# Altium schematic sheet MD017A ISO-F28027F_0.SchDoc: LAUNCHXL-F28027 NewVersion
size 301 x 237 mm; Date: 7/10/2018 10:05:18 AM; SheetNumber: 1
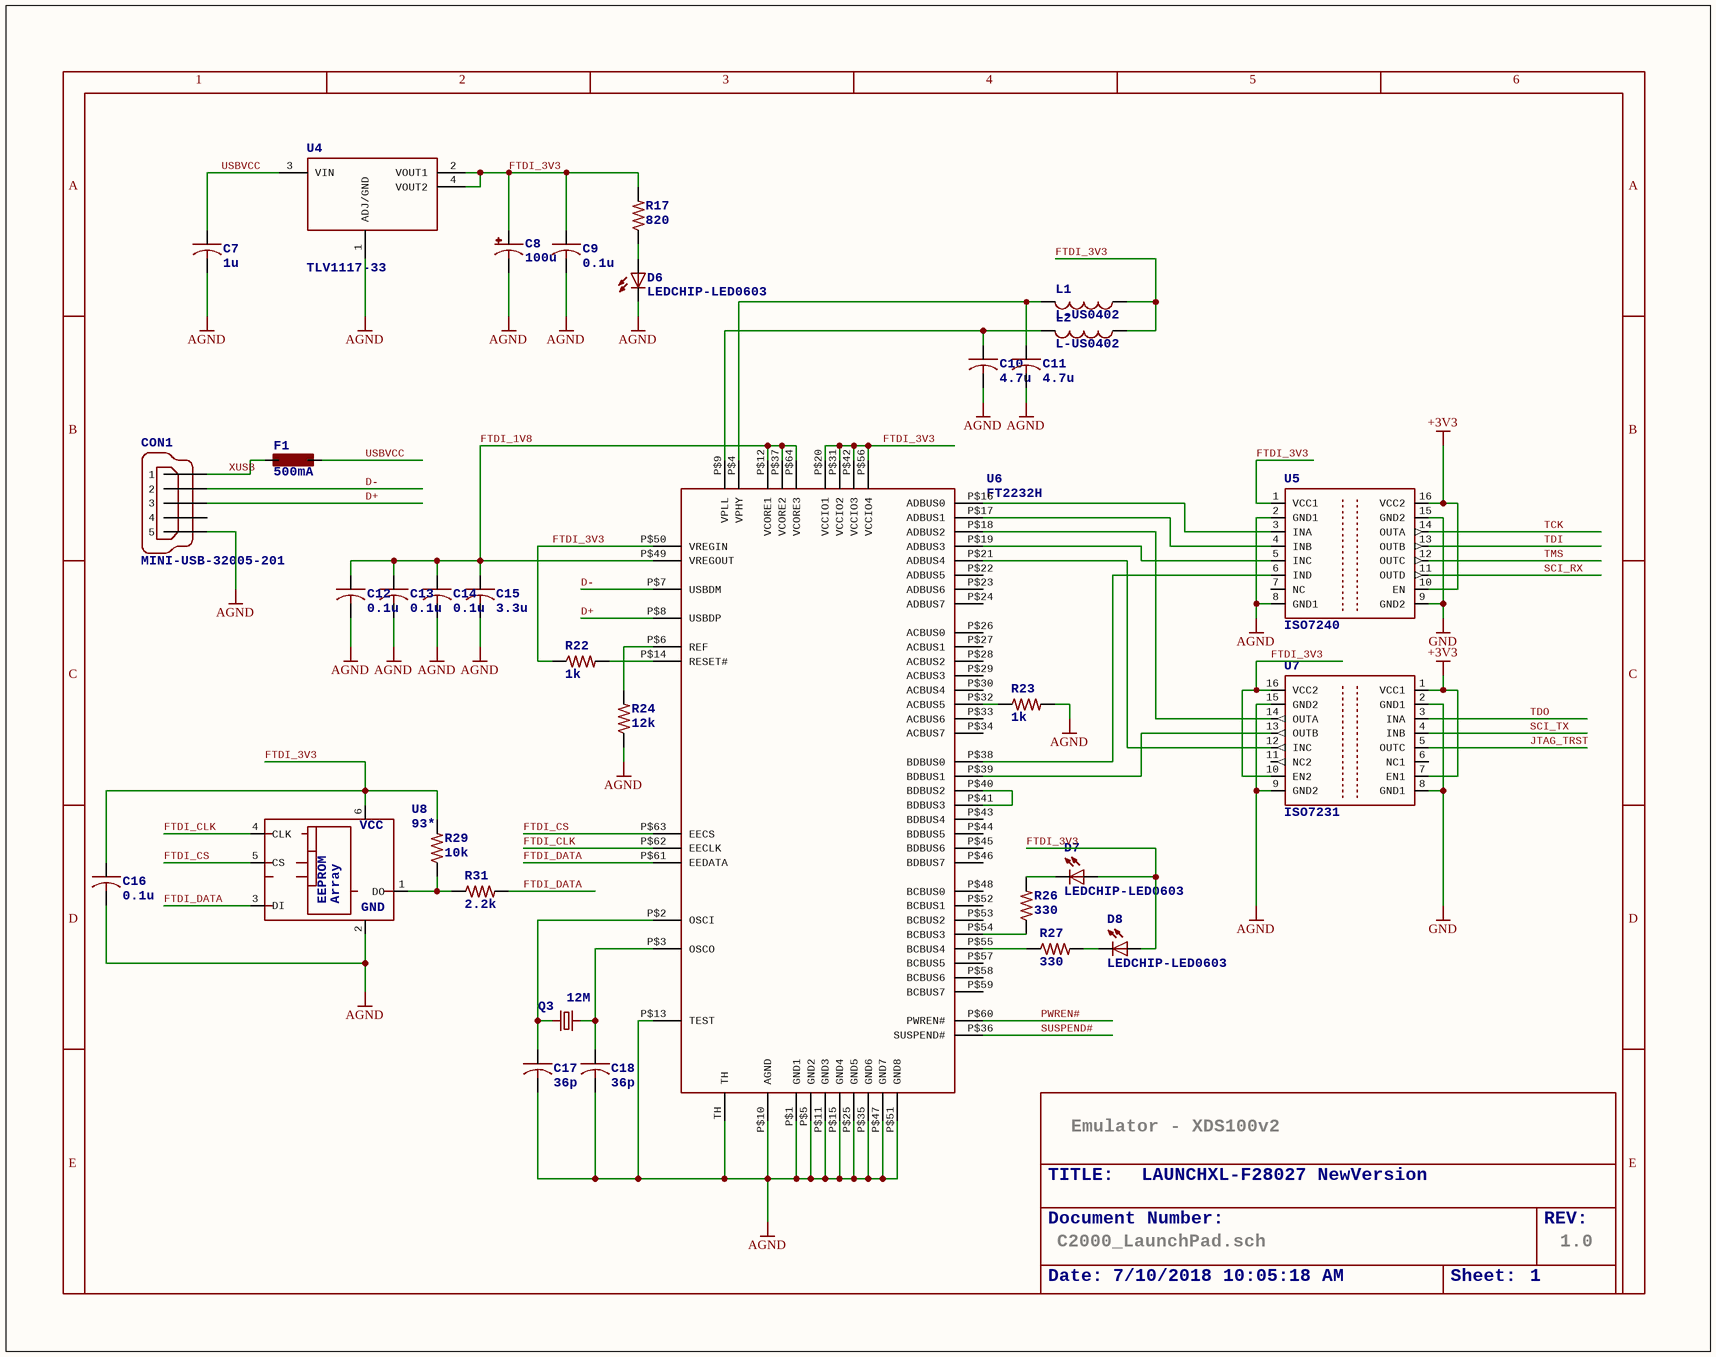
[diagram p0: MD017A ISO-F28027F_0.SchDoc]

## Parts
C7  1u  [C0402]
C8  100u  [B/3528-21R]
C9  0.1u  [C0402]
C10  4.7u  [C0402]
C11  4.7u  [C0402]
C12  0.1u  [C0402]
C13  0.1u  [C0402]
C14  0.1u  [C0402]
C15  3.3u  [C0402]
C16  0.1u  [C0402]
C17  36p  [C0402]
C18  36p  [C0402]
CON1  MINI-USB-32005-201  [32005-201]
D6  LEDCHIP-LED0603  [CHIP-LED0603]
D7  LEDCHIP-LED0603  [CHIP-LED0603]
D8  LEDCHIP-LED0603  [CHIP-LED0603]
F1  500mA  [L1812]
L1  L-US0402  [R0402]
L2  L-US0402  [R0402]
Q3  12M  [HC49UP]
R17  820  [R0402]
R22  1k  [R0402]
R23  1k  [R0402]
R24  12k  [R0402]
R26  330  [R0402]
R27  330  [R0402]
R29  10k  [R0402]
R31  2.2k  [R0402]
U4  TLV1117-33  [SOT223]
U5  ISO7240  [SO-16DW]
U6  FT2232H  [QFN64]
U7  ISO7231  [SO-16DW]
U8  93*  [SOT23-6]

## Nets
+3V3: U5.10(EN) U5.16(VCC2) U7.1(VCC1) U7.7(EN1)
AGND: C7.2 C8.- C9.2 C10.2 C11.2 C12.2 C13.2 C14.2 C15.2 C16.2 C17.2 C18.2 CON1.5 D6.C R23.2 R24.1 U4.1(ADJ/GND) U5.2(GND1) U5.8(GND1) U6.P$1(GND1) U6.P$5(GND2) U6.P$10(AGND) U6.P$11(GND3) U6.P$13(TEST) U6.P$15(GND4) U6.P$25(GND5) U6.P$35(GND6) U6.P$47(GND7) U6.P$51(GND8) U6.TH U7.9(GND2) U7.15(GND2) U8.2(GND)
GND: U5.9(GND2) U5.15(GND2) U7.2(GND1) U7.8(GND1)
D+: CON1.3 U6.P$8(USBDP)
D-: CON1.2 U6.P$7(USBDM)
FTDI_1V8: C12.1 C13.1 C14.1 C15.1 U6.P$12(VCORE1) U6.P$37(VCORE2) U6.P$49(VREGOUT) U6.P$64(VCORE3)
FTDI_3V3: C8.+ C9.1 C16.1 D7.A D8.A L1.1 L2.1 R17.2 R22.1 R29.2 U4.2(VOUT1) U4.4(VOUT2) U5.1(VCC1) U6.P$20(VCCIO1) U6.P$31(VCCIO2) U6.P$42(VCCIO3) U6.P$50(VREGIN) U6.P$56(VCCIO4) U7.10(EN2) U7.16(VCC2) U8.6(VCC)
FTDI_CLK: U6.P$62(EECLK) U8.4(CLK)
FTDI_CS: U6.P$63(EECS) U8.5(CS)
FTDI_DATA: R31.2 U6.P$61(EEDATA) U8.3(DI)
JTAG_TRST: U7.5(OUTC)
PWREN#: U6.P$60(PWREN#)
SCI_RX: U5.11(OUTD)
SCI_TX: U7.4(INB)
SUSPEND#: U6.P$36(SUSPEND#)
TCK: U5.14(OUTA)
TDI: U5.13(OUTB)
TDO: U7.3(INA)
TMS: U5.12(OUTC)
USBVCC: C7.1 F1.1 U4.3(VIN)
XUSB: CON1.1 F1.2
NetC10_1: C10.1 L2.2 U6.P$9(VPLL)
NetC11_1: C11.1 L1.2 U6.P$4(VPHY)
NetC17_1: C17.1 Q3.1 U6.P$2(OSCI)
NetC18_1: C18.1 Q3.2 U6.P$3(OSCO)
NetD6_A: D6.A R17.1
NetD7_C: D7.C R26.2
NetD8_C: D8.C R27.2
NetR22_2: R22.2 U6.P$14(RESET#)
NetR23_1: R23.1 U6.P$32(ACBUS5)
NetR24_2: R24.2 U6.P$6(REF)
NetR26_1: R26.1 U6.P$54(BCBUS3)
NetR27_1: R27.1 U6.P$55(BCBUS4)
NetR29_1: R29.1 R31.1 U8.1(DO)
NetU5_3: U5.3(INA) U6.P$16(ADBUS0)
NetU5_4: U5.4(INB) U6.P$17(ADBUS1)
NetU5_5: U5.5(INC) U6.P$19(ADBUS3)
NetU5_6: U5.6(IND) U6.P$38(BDBUS0)
NetU6_P$18: U6.P$18(ADBUS2) U7.14(OUTA)
NetU6_P$21: U6.P$21(ADBUS4) U7.12(INC)
NetU6_P$39: U6.P$39(BDBUS1) U7.13(OUTB)
NetU6_P$40: U6.P$40(BDBUS2) U6.P$41(BDBUS3)

Not connected (* = marked no-connect by the designer): CON1 4; U5 7(NC); U6 P$22(ADBUS5) P$23(ADBUS6) P$24(ADBUS7) P$26(ACBUS0) P$27(ACBUS1) P$28(ACBUS2) P$29(ACBUS3) P$30(ACBUS4) P$33(ACBUS6) P$34(ACBUS7) P$43(BDBUS4) P$44(BDBUS5) P$45(BDBUS6) P$46(BDBUS7) P$48(BCBUS0) P$52(BCBUS1) P$53(BCBUS2) P$57(BCBUS5) P$58(BCBUS6) P$59(BCBUS7); U7 6(NC1) 11(NC2)

## Notes on the sheet
- Emulator - XDS100v2
- TITLE:
- Document Number:
- LAUNCHXL-F28027 NewVersion
- REV:
- Date:
- C2000_LaunchPad.sch
- 7/10/2018 10:05:18 AM
- Sheet:
- 1
- 1.0
- 2
- 3
- 4
- 5
- 6
- A
- B
- C
- D
- E

## Library data of the parts
C7 C9-C18 = C-USC0402: CAPACITOR, American symbol
C8 = CPOL-USB/3528-21R: POLARIZED CAPACITOR, American symbol
CON1 = MINI-USB-32005-201: MINI USB-B Conector   Source: www.cypressindustries.com; OC_FARNELL: unknown; OC_NEWARK: unknown
D6-D8 = LEDCHIP-LED0603: LED   OSRAM: - CHIPLED LG R971, LG N971, LY N971, LG Q971, LY Q971, LO R971, LY R971 LH N974, LH R974 LS Q976, LO Q976, LY Q976 LO Q996 - Hyper CHIPLED LW Q18S LB Q993, LB Q99A, LB R99A - SideLED LS A670, LO A670, LY A670, LG A670, LP A670 LB A673, LV A673, LT A673, LW A673 LH A674 LY A675 LS A676, LA A676, LO A676, LY A676, LW A676 LS A679, LY A679, LG A679 -  Hyper Micro SIDELED® LS Y876, LA Y876, LO Y876, LY Y876 LT Y87S - SmartLED LW L88C, LW L88S LB L89C, LB L89S, LG L890 LS L89K, LO L89K, LY L89K LS L896, LA L896, LO L896, LY L896 - TOPLED LS T670, LO T670, LY T670, LG T670, LP T670 LSG T670, LSP T670, LSY T670, LOP T670, LYG T670 LG T671, LOG T671, LSG T671 LB T673, LV T673, LT T673, LW T673 LH T674 LS T676, LA T676, LO T676, LY T676, LB T676, LH T676, LSB T676, LW T676 LB T67C, LV T67C, LT T67C, LS T67K, LO T67K, LY T67K, LW E67C LS E67B, LA E67B, LO E67B, LY E67B, LB E67C, LV E67C, LT E67C LW T67C LS T679, LY T679, LG T679 LS T770, LO T770, LY T770, LG T770, LP T770 LB T773, LV T773, LT T773, LW T773 LH T774 LS E675, LA E675, LY E675, LS T675 LS T776, LA T776, LO T776, LY T776, LB T776 LHGB T686 LT T68C, LB T68C - Hyper Mini TOPLED® LB M676 - Mini TOPLED Santana® LG M470 LS M47K, LO M47K, LY M47K    Source: http://www.osram.convergy.de   LUXEON: - LUMILED® LXK2-PW12-R00, LXK2-PW12-S00, LXK2-PW14-U00, LXK2-PW14-V00 LXK2-PM12-R00, LXK2-PM12-S00, LXK2-PM14-U00 LXK2-PE12-Q00, LXK2-PE12-R00, LXK2-PE12-S00, LXK2-PE14-T00, LXK2-PE14-U00 LXK2-PB12-K00, LXK2-PB12-L00, LXK2-PB12-M00, LXK2-PB14-N00, LXK2-PB14-P00, LXK2-PB14-Q00 LXK2-PR12-L00, LXK2-PR12-M00, LXK2-PR14-Q00, LXK2-PR14-R00 LXK2-PD12-Q00, LXK2-PD12-R00, LXK2-PD12-S00 LXK2-PH12-R00, LXK2-PH12-S00 LXK2-PL12-P00, LXK2-PL12-Q00, LXK2-PL12-R00    Source: www.luxeon.com   KINGBRIGHT:   KA-3528ASYC Source: www.kingbright.com
F1 = L-EUL1812: INDUCTOR, European symbol
L1 L2 = L-US0402: INDUCTOR, American symbol
Q3 = CRYSTALHC49UP: CRYSTAL
R17 R22-R24 R26 R27 R29 R31 = R-US_R0402: RESISTOR, American symbol
U5 = ISO7240: HIGH SPEED QUAD DIGITAL ISOLATORS   Source: http://focus.ti.com/lit/ds/symlink/iso7240m.pdf; MPN: ISO7240MDW; OC_FARNELL: 1755124; OC_NEWARK: 58M0385
U8 = 93*: Serial EPROM   1 K/2 K/4 K, low voltage, Microwire; Array: Array; VCC: VCC; GND: GND; EEPROM: EEPROM